# Altium schematic sheet SH4 - SD CARD.SchDoc: SD Card Interface
size B; CheckedBy: Wolfgang Windholtz; Engineer: Cindy Li; Revision: 1; SheetNumber: 4; SheetTotal: 6
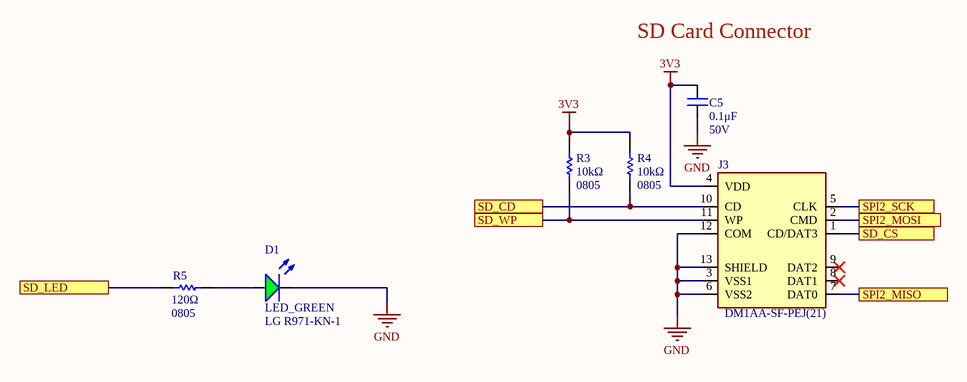
[diagram p0: SH4 - SD CARD.SchDoc]

## Parts
C5  value 0.1μF  Voltage Rating: 50V  [CAP2012]  (hidden comment: CAP_0.1uF_50V_0805)
D1  LED_GREEN  Manufacturer Part Number 1: LG R971-KN-1  [LED_0805_GREEN]
J3  Manufacturer Part Number 1: DM1AA-SF-PEJ(21)  [HRS_DM1AA-SF-PEJ(21)]  (hidden comment: CON_SD_CARD)
R3  value 10kΩ  Package/Footprint: 0805  [RES0805]  (hidden comment: RES_10kΩ_0805_5%)
R4  value 10kΩ  Package/Footprint: 0805  [RES0805]  (hidden comment: RES_10kΩ_0805_5%)
R5  value 120Ω  Package/Footprint: 0805  [RESC0805]  (hidden comment: RES_120Ω_0805_1%)

## Ports
SD_CD, SD_CS, SD_LED, SD_WP, SPI2_MISO, SPI2_MOSI, SPI2_SCK

## Nets
3V3: C5.2 J3.4(VDD) R3.2 R4.2
GND: C5.1 D1.2(K) J3.3(VSS1) J3.6(VSS2) J3.12(COM) J3.13(SHIELD)
SD_CD: J3.10(CD) R4.1 ; port SD_CD
SD_CS: J3.1(CD/DAT3) ; port SD_CS
SD_LED: R5.1 ; port SD_LED
SD_WP: J3.11(WP) R3.1 ; port SD_WP
SPI2_MISO: J3.7(DAT0) ; port SPI2_MISO
SPI2_MOSI: J3.2(CMD) ; port SPI2_MOSI
SPI2_SCK: J3.5(CLK) ; port SPI2_SCK
NetD1_1: D1.1(A) R5.2

Not connected (* = marked no-connect by the designer): J3 8(DAT1)* 9(DAT2)*

## Notes on the sheet
- SD Card Connector
- Title:
- Project:
- Date:
- Rev:
- Checker:
- Engineer:
- Sheet:
- of

## Library data of the parts
C5 = CAP_0.1uF_50V_0805: CAP CER 0.1UF 50V X7R 0805; Manufacturer 1: Murata Electronics; Manufacturer Part Number 1: GCM21BR71H104KA37K; Package/Footprint: 0805; Dielectric: X7R; Supplier 1: Digi-Key; Supplier Part Number 1: 490-8049-1-ND; Mounting Type: SMD; LCSC Part #: C49678
D1 = LED_GREEN: LED GREEN DIFFUSED 0805 SMD; Manufacturer 1: OSRAM; Forward Voltage Drop: 2.2V; Package/Footprint: 0805; Supplier Part Number 1: 475-1410-1-ND; Supplier 1: Digi-Key; Mounting Type: SMD
J3 = CON_SD_CARD: CONN SD CARD PUSH-PUSH R/A SMD; Manufacturer 1: Hirose Electric Co Ltd; Supplier 1: Digi-Key; Supplier Part Number 1: HR845CT-ND
R3 R4 = RES_10kΩ_0805_5%: RES 10K OHM 5% 1/8W 0805; Manufacturer 1: Panasonic Electronic Components; Manufacturer Part Number 1: ERJ-6GEYJ103V; Supplier Part Number 1: P10KACT-ND; Supplier 1: Digi-Key; Mounting Type: SMD; LCSC Part #: C17414
R5 = RES_120Ω_0805_1%: RES 120 OHM 1% 1/8W 0805; Manufacturer 1: Vishay; Manufacturer Part Number 1: CRCW0805120RFKEA; Supplier Part Number 1: 541-120CCT-ND; Supplier 1: Digi-Key; Mounting Type: SMD; LCSC Part #: C17437